# Altium schematic sheet Esquematico_Wattimetro.SchDoc
size A4
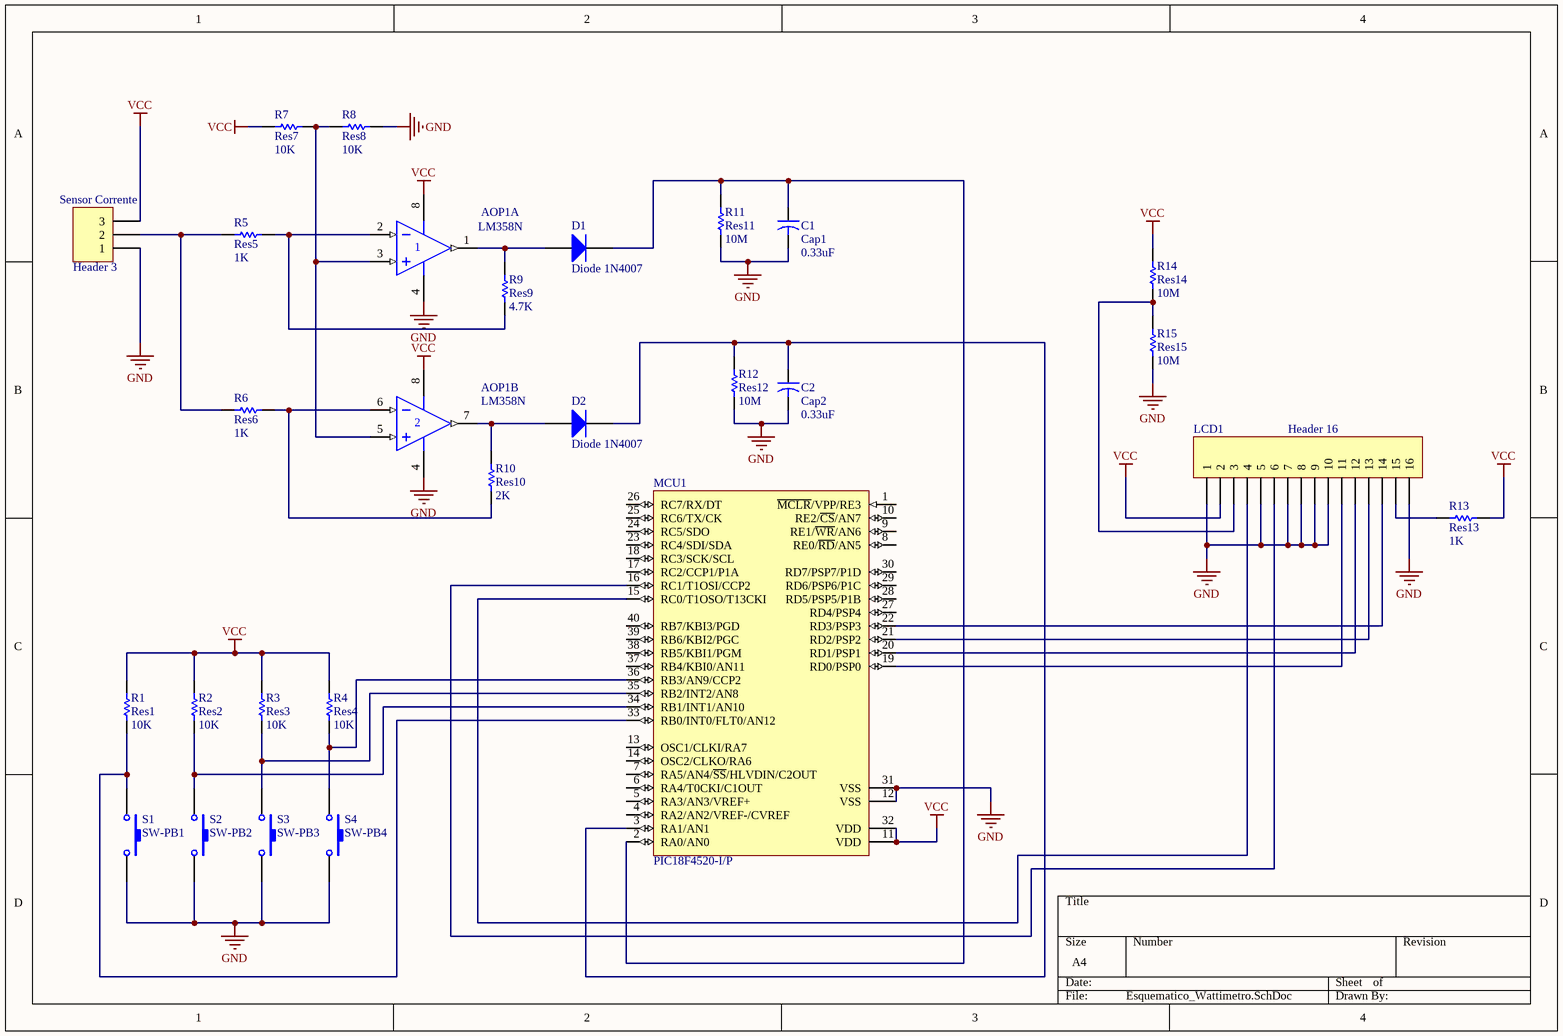
[diagram p0: Esquematico_Wattimetro.SchDoc]

## Parts
AOP1  LM358N  [626-05]  (parts A,B of 2)
C1  Cap1  value 0.33uF  [CAPR5-4X5]
C2  Cap2  value 0.33uF  [CAPR5-4X5]
D1  Diode 1N4007  [DO-41]
D2  Diode 1N4007  [DO-41]
LCD1  Header 16  [HDR1X16]
MCU1  PIC18F4520-I/P  [PDIP600-P40]
R1  Res1  value 10K  [AXIAL-0.3]
R2  Res2  value 10K  [AXIAL-0.3]
R3  Res3  value 10K  [AXIAL-0.3]
R4  Res4  value 10K  [AXIAL-0.3]
R5  Res5  value 1K  [AXIAL-0.3]
R6  Res6  value 1K  [AXIAL-0.3]
R7  Res7  value 10K  [AXIAL-0.3]
R8  Res8  value 10K  [AXIAL-0.3]
R9  Res9  value 4.7K  [AXIAL-0.3]
R10  Res10  value 2K  [AXIAL-0.3]
R11  Res11  value 10M  [AXIAL-0.3]
R12  Res12  value 10M  [AXIAL-0.3]
R13  Res13  value 1K  [AXIAL-0.3]
R14  Res14  value 10M  [AXIAL-0.3]
R15  Res15  value 10M  [AXIAL-0.3]
S1  SW-PB1  [SPST-2]
S2  SW-PB2  [SPST-2]
S3  SW-PB3  [SPST-2]
S4  SW-PB4  [SPST-2]
Sensor_Corrente  Header 3  [HDR1X3]

## Nets
GND: AOP1.4(V-) C1.2 C2.2 LCD1.1 LCD1.5 LCD1.7 LCD1.8 LCD1.9 LCD1.10 LCD1.16 MCU1.12(VSS) MCU1.31(VSS) R8.1 R11.1 R12.1 R15.1 S1.2 S2.2 S3.2 S4.2 Sensor_Corrente.1
VCC: AOP1.8(V+) LCD1.2 MCU1.11(VDD) MCU1.32(VDD) R1.2 R2.2 R3.2 R4.2 R7.2 R13.1 R14.2 Sensor_Corrente.3
NetAOP1_1: AOP1.1(OUT) D1.1(A) R9.2
NetAOP1_2: AOP1.2(IN-) R5.2 R9.1
NetAOP1_3: AOP1.3(IN+) AOP1.5(IN+) R7.1 R8.2
NetAOP1_6: AOP1.6(IN-) R6.2 R10.2
NetAOP1_7: AOP1.7(OUT) D2.1(A) R10.1
NetC1_1: C1.1 D1.2(K) MCU1.2(RA0/AN0) R11.2
NetC2_1: C2.1 D2.2(K) MCU1.3(RA1/AN1) R12.2
NetLCD1_3: LCD1.3 R14.1 R15.2
NetLCD1_4: LCD1.4 MCU1.15(RC0/T1OSO/T13CKI)
NetLCD1_6: LCD1.6 MCU1.16(RC1/T1OSI/CCP2)
NetLCD1_11: LCD1.11 MCU1.19(RD0/PSP0)
NetLCD1_12: LCD1.12 MCU1.20(RD1/PSP1)
NetLCD1_13: LCD1.13 MCU1.21(RD2/PSP2)
NetLCD1_14: LCD1.14 MCU1.22(RD3/PSP3)
NetLCD1_15: LCD1.15 R13.2
NetMCU1_33: MCU1.33(RB0/INT0/FLT0/AN12) R1.1 S1.1
NetMCU1_34: MCU1.34(RB1/INT1/AN10) R2.1 S2.1
NetMCU1_35: MCU1.35(RB2/INT2/AN8) R3.1 S3.1
NetMCU1_36: MCU1.36(RB3/AN9/CCP2) R4.1 S4.1
NetR5_1: R5.1 R6.1 Sensor_Corrente.2

Not connected (* = marked no-connect by the designer): MCU1 1(~{MCLR}/VPP/RE3) 4(RA2/AN2/VREF-/CVREF) 5(RA3/AN3/VREF+) 6(RA4/T0CKI/C1OUT) 7(RA5/AN4/~{SS}/HLVDIN/C2OUT) 8(RE0/~{RD}/AN5) 9(RE1/~{WR}/AN6) 10(RE2/~{CS}/AN7) 13(OSC1/CLKI/RA7) 14(OSC2/CLKO/RA6) 17(RC2/CCP1/P1A) 18(RC3/SCK/SCL) 23(RC4/SDI/SDA) 24(RC5/SDO) 25(RC6/TX/CK) 26(RC7/RX/DT) 27(RD4/PSP4) 28(RD5/PSP5/P1B) 29(RD6/PSP6/P1C) 30(RD7/PSP7/P1D) 37(RB4/KBI0/AN11) 38(RB5/KBI1/PGM) 39(RB6/KBI2/PGC) 40(RB7/KBI3/PGD)

## Library data of the parts
AOP1 = LM358N: Dual Low-Power Operational Amplifier; Published: 17-Jul-2002; LatestRevisionDate: 06-Jun-2005; LatestRevisionNote: Stylized 3D Model Added.; DatasheetVersion: 1988; PackageReference: 626-05; Publisher: Altium Limited; PackageDescription: DIP; 8 Leads; Row Spacing 7.62 mm; Pitch 2.54 mm; ComponentLink1Description: Manufacturer Link; ComponentLink1URL: http://www.onsemi.com/site/products/parametrics/0,4446,251,00.html; ComponentLink2Description: Datasheet; ComponentLink2URL: http://www.onsemi.com/pub/Collateral/LM358-D.PDF
C1 C2 = Cap2: Capacitor; Published: 23-Sep-2002; PackageReference: CAPR5-4X5; Publisher: Altium Limited
D1 D2 = Diode 1N4007: 1 Amp General Purpose Rectifier; Published: 8-Jun-2000; LatestRevisionDate: 17-Jul-2002; LatestRevisionNote: Re-released for DXP Platform.; DatasheetDocument: 1998; PackageDocument: Aug-1999; PackageReference: DO-41; Publisher: Altium Limited; Code_JEDEC: DO-204-AL; ComponentLink1Description: Manufacturer Link; ComponentLink1URL: http://www.fairchildsemi.com/; ComponentLink2Description: Datasheet; ComponentLink2URL: http://www.fairchildsemi.com/ds/1N%2F1N4001.pdf
LCD1 = Header 16: Header, 16-Pin; LatestRevisionDate: 17-Jul-2002; LatestRevisionNote: Re-released for DXP Platform.; Publisher: Altium Limited
MCU1 = PIC18F4520-I/P: Enhanced Flash Microcontroller with 10-Bit A/D and nanoWatt Technology, 32K Flash, 40-Pin PDIP, Industrial Temperature Range; Published: 29-Jan-2009; LatestRevisionDate: 02-Dec-2009; LatestRevisionNote: Updated to datasheet revision E, Oct-2008; DatasheetVersion: revE, Oct-2008; PackageVersion: revBB, Aug-2009; PackageReference: PDIP600-P40; Publisher: Altium Limited; PackageDescription: 40-Lead Plastic Dual In-Line (P) - 600 mil Body [PDIP]; Supplier 1: Digi-Key; Supplier Part Number 1: PIC18F4520-I/P-ND; Supplier 2: Farnell; Supplier Part Number 2: 1523812; Supplier 3: Farnell; Supplier Part Number 3: 1212702; ComponentLink1Description: Datasheet; ComponentLink1URL: http://ww1.microchip.com/downloads/en/DeviceDoc/39631E.pdf; ComponentLink2Description: Packaging Specification; ComponentLink2URL: http://www.microchip.com/stellent/groups/techpub_sg/documents/packagingspec/en012702.pdf; ComponentLink3Description: Microchip.com Home; ComponentLink3URL: http://www.microchip.com/
R1-R15 = Res1: Resistor; Published: 8-Jun-2000; LatestRevisionDate: 17-Jul-2002; LatestRevisionNote: Re-released for DXP Platform.; PackageReference: AXIAL-0.3; Publisher: Altium Limited
S1-S4 = SW-PB: Switch; Published: 24-Mar-1999; LatestRevisionDate: 17-Jul-2002; LatestRevisionNote: Re-released for DXP Platform.; PackageReference: SPST-2; Publisher: Altium Limited
Sensor_Corrente = Header 3: Header, 3-Pin; LatestRevisionDate: 17-Jul-2002; LatestRevisionNote: Re-released for DXP Platform.; Publisher: Altium Limited